# EAGLE board PCB1 (EAGLE 9.3.1), part 1 of 2
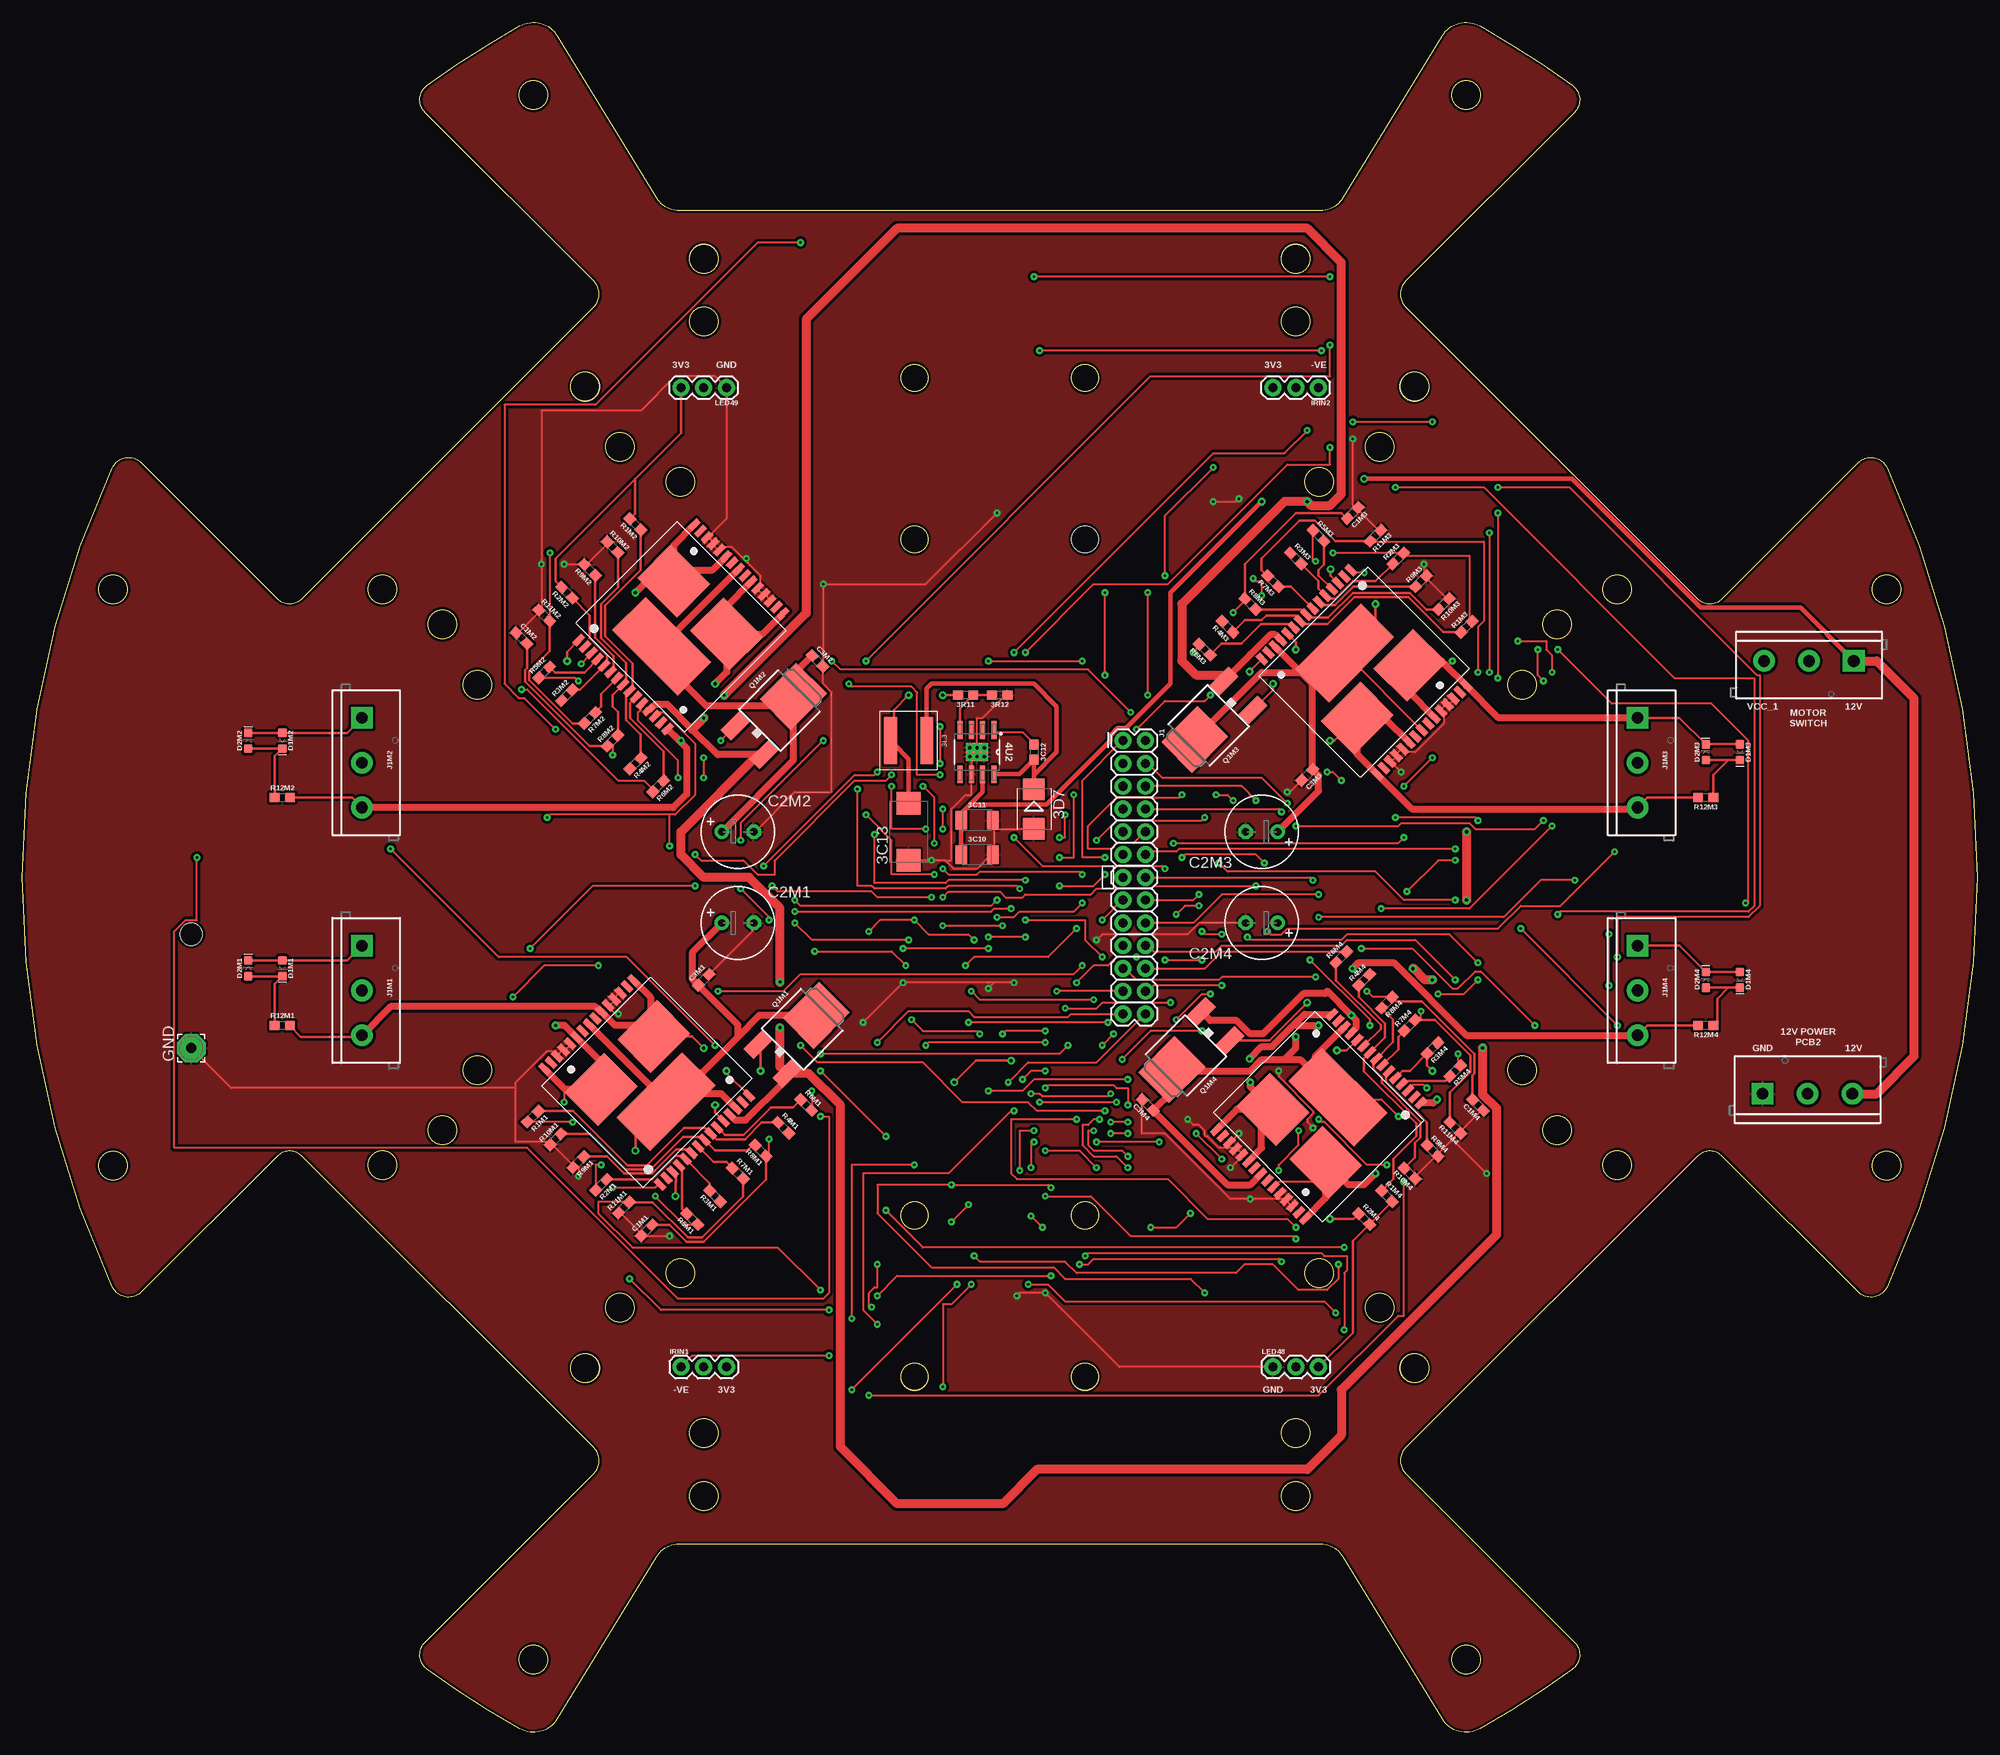
[diagram p4: board, top side]
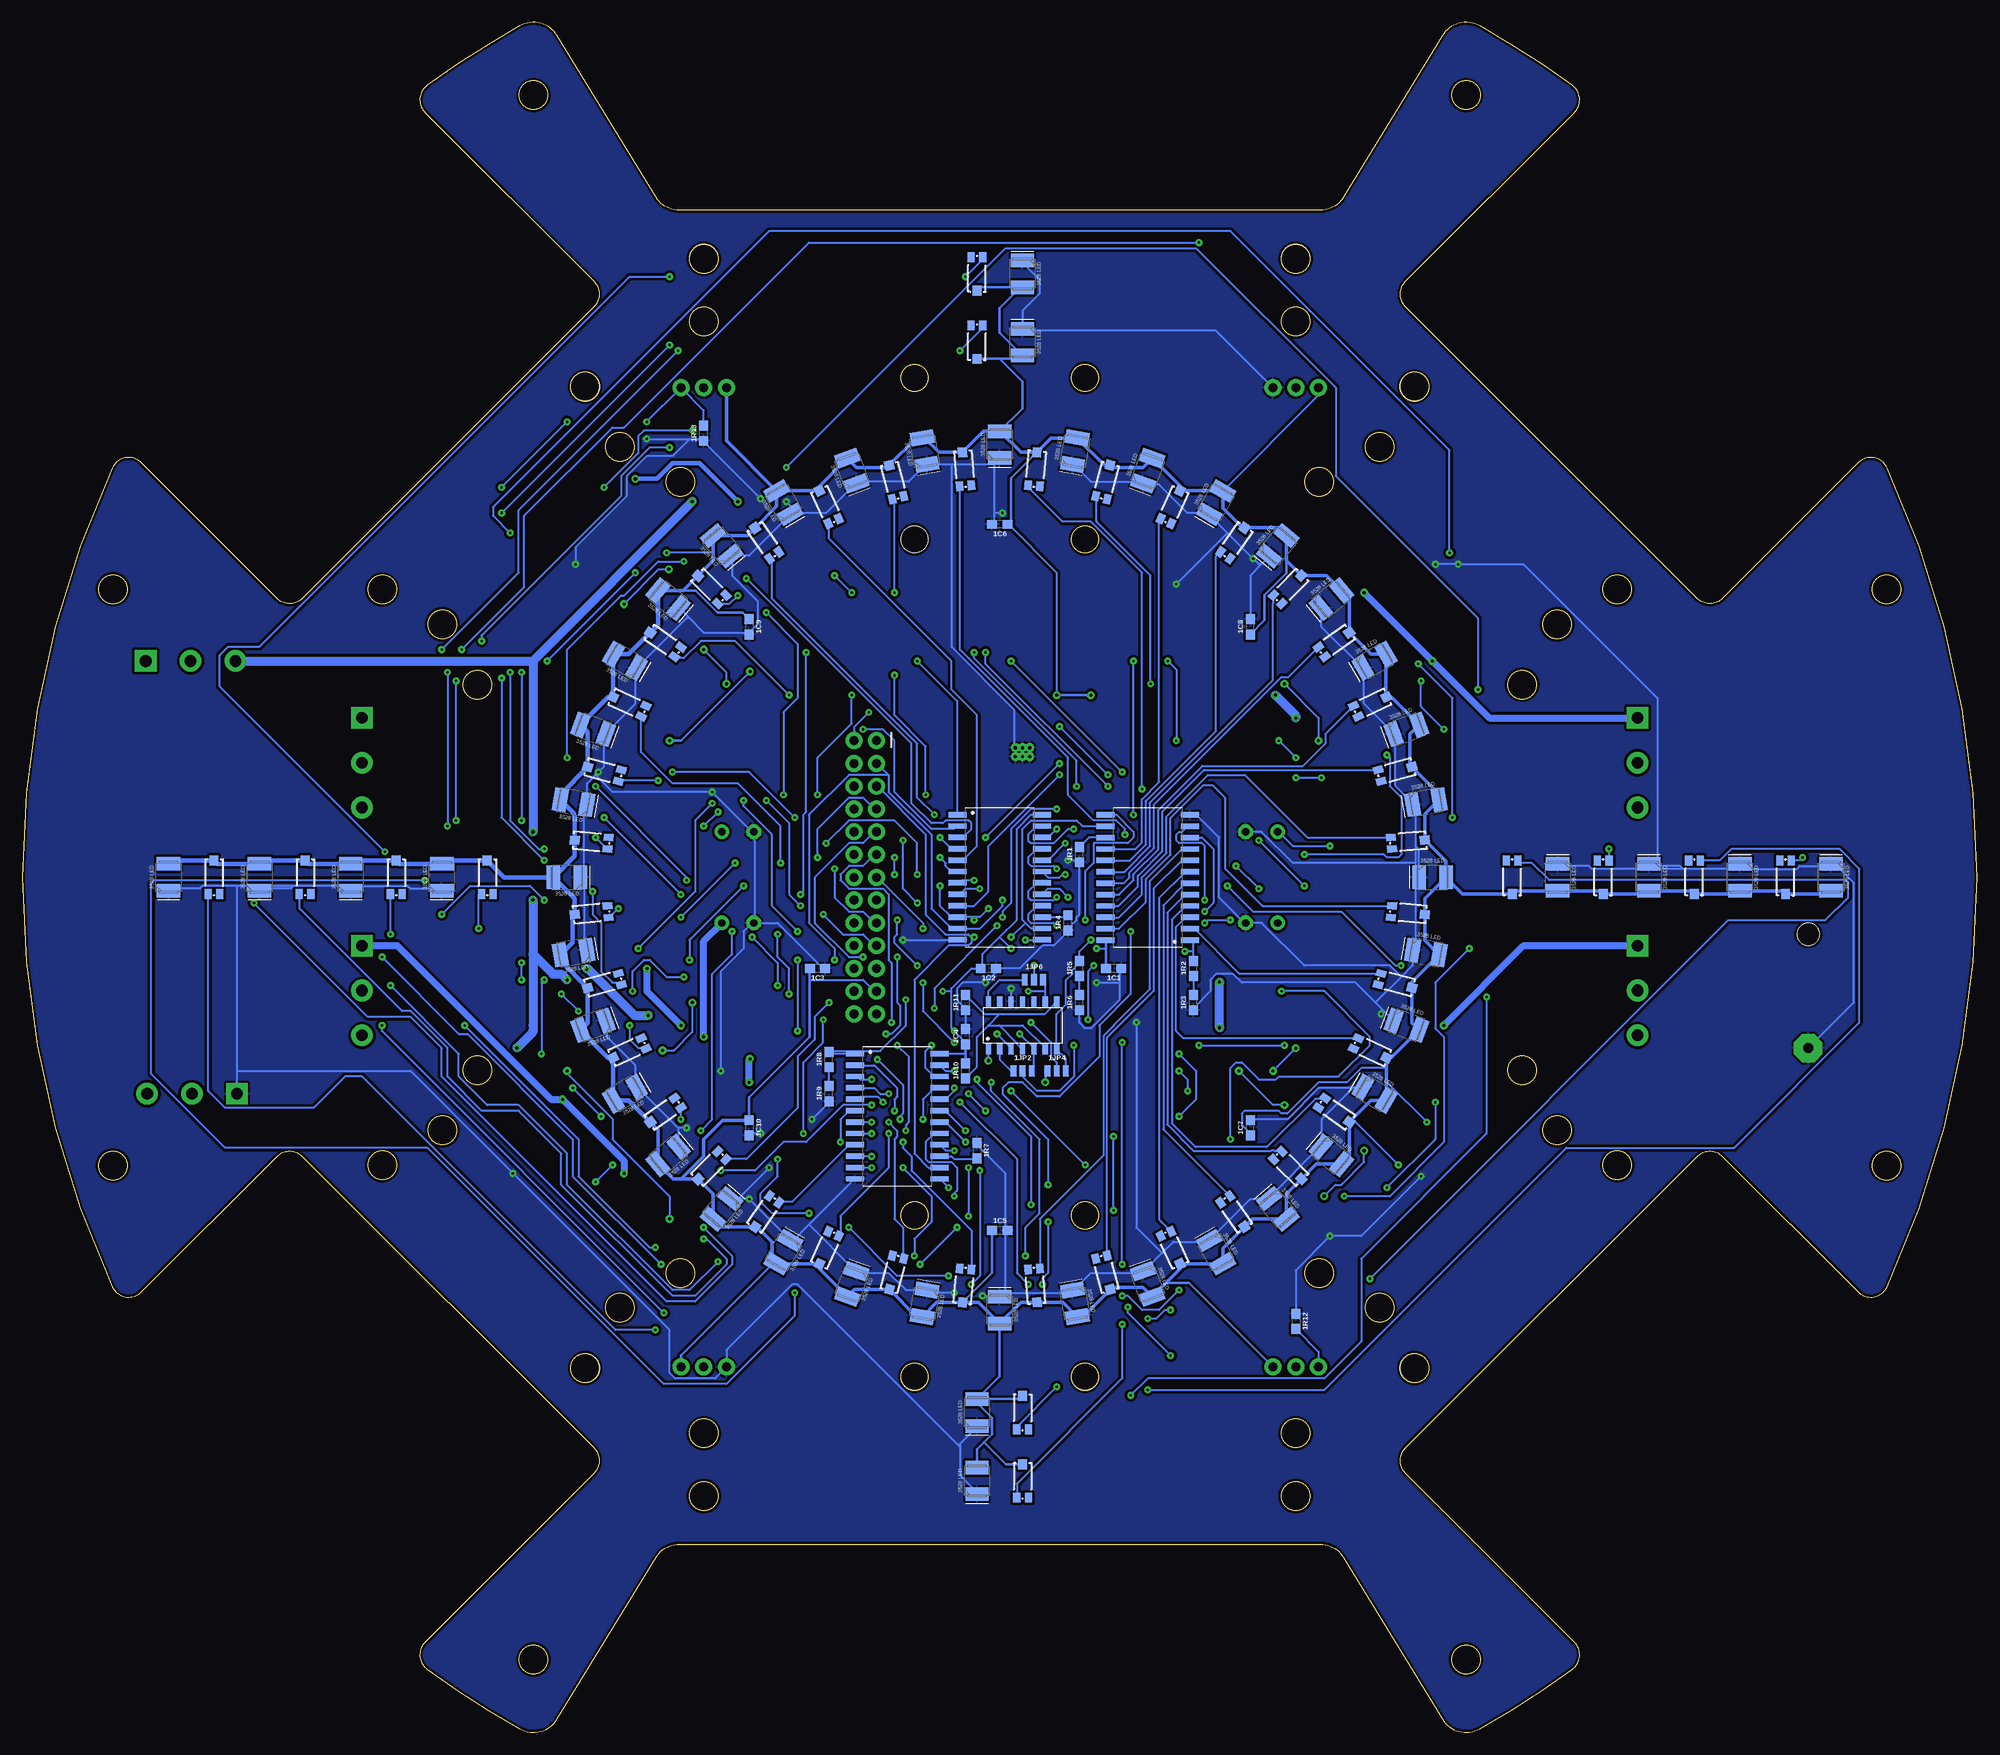
[diagram p5: board, bottom side, seen from below]

Size 218 x 190.7 mm. Coordinates in mm from the lower left corner, seen from the top.
Outline: 207.97,141.02 arc-50 207.97,49.68 arc-110 204.74,49.11 189.61,64.24 arc90 186.78,64.24 154.26,31.71 arc90 154.26,28.88 173.09,10.05 arc-99 172.85,7.01 arc-6 162.53,0.4 arc-88 158.35,1.49 147.34,19.52 arc59 144.78,20.95 73.22,20.95 arc59 70.66,19.52 59.65,1.49 arc-88 55.48,0.4 arc-6 45.15,7.01 arc-99 44.91,10.05 63.75,28.88 arc90 63.75,31.71 31.22,64.24 arc90 28.39,64.24 13.26,49.11 arc-110 10.03,49.68 arc-50 10.03,141.02 arc-110 13.26,141.6 28.39,126.46 arc90 31.22,126.46 63.75,158.99 arc90 63.75,161.82 44.91,180.66 arc-99 45.15,183.69 arc-6 55.48,190.3 arc-88 59.65,189.22 70.66,171.19 arc59 73.22,169.75 144.78,169.75 arc59 147.34,171.19 158.35,189.22 arc-88 162.53,190.3 arc-6 172.85,183.69 arc-99 173.09,180.66 154.26,161.82 arc90 154.26,158.99 186.78,126.46 arc90 189.61,126.46 204.74,141.6 arc-110 207.97,141.02
Outline: circle at 118.5,57.65 radius 1.5
Outline: circle at 118.5,39.65 radius 1.5
Outline: circle at 99.5,57.65 radius 1.5
Outline: circle at 99.5,39.65 radius 1.5
Outline: circle at 46.85,67.14 radius 1.6
Outline: circle at 66.64,47.34 radius 1.6
Outline: circle at 50.73,73.86 radius 1.6
Outline: circle at 40.13,63.25 radius 1.6
Outline: circle at 62.76,40.62 radius 1.6
Outline: circle at 73.36,51.23 radius 1.6
Outline: circle at 171.15,67.14 radius 1.6
Outline: circle at 151.36,47.34 radius 1.6
Outline: circle at 167.27,73.86 radius 1.6
Outline: circle at 177.87,63.25 radius 1.6
Outline: circle at 155.24,40.62 radius 1.6
Outline: circle at 144.64,51.23 radius 1.6
Outline: circle at 10.09,63.21 radius 1.6
Outline: circle at 207.91,63.21 radius 1.6
Outline: circle at 76,26.35 radius 1.6
Outline: circle at 76,33.35 radius 1.6
Copper layers (1*16): Top 0.035mm / dielectric 1.5mm / Bottom 0.035mm
Design rules "mine *": minimum track width 8mil, minimum drill 10mil, track to track 8mil, track to pad 8mil, pad to pad 8mil, via to via 8mil, smd to smd 8mil, copper to edge 8mil, drill to drill 8mil, minimum pad ring 12mil, minimum via ring 10mil, stop-mask expansion 4mil, vias tented up to drill 25mil, thermal gap 10mil
Holes 2.5 mm at 18.83,89
Holes 3 mm at 118.5,133.05 99.5,133.05 99.5,151.05 118.5,151.05 118.5,57.65 99.5,57.65 99.5,39.65 118.5,39.65
Holes 3.2 mm at 76,164.35 76,157.35 73.36,139.47 62.76,150.08 66.64,143.36 57,182.6 151.36,143.36 161,182.6 142,164.35 142,157.35 155.24,150.08 144.64,139.47 50.73,116.85 46.85,123.57 40.13,127.45 10.09,127.49 10.09,63.21 40.13,63.25 46.85,67.14 50.73,73.86 73.36,51.23 66.64,47.34 62.76,40.62 76,33.35 76,26.35 57,8.1 142,33.35 142,26.35 161,8.1 155.24,40.62 151.36,47.34 144.64,51.23 177.87,63.25 171.15,67.14 167.27,73.86 207.91,63.21 207.91,127.49 177.87,127.45 171.15,123.57 167.27,116.85

## Footprints (pad centres in the part's own frame; a part is rotated, then mirrored left to right if it is on the bottom)
0603 = smd 1.1 x 1: 1 -0.85,0; 2 0.85,0
SMT-JUMPER_3_0-NO_TRACE_NO-SILK = smd 0.635 x 1.27: 1 -1.016,0; 2 0,0; 3 1.016,0
SOIC-14 = smd 1.18 x 0.58: P1 -2.66,3.81; P2 -2.66,2.54; P3 -2.66,1.27; P4 -2.66,0; P5 -2.66,-1.27; P6 -2.66,-2.54; P7 -2.66,-3.81; P8 2.66,-3.81; P9 2.66,-2.54; P10 2.66,-1.27; P11 2.66,0; P12 2.66,1.27; P13 2.66,2.54; P14 2.66,3.81
SOIC-24 = smd 2 x 0.6: P1 -4.7,7; P2 -4.7,5.73; P3 -4.7,4.46; P4 -4.7,3.19; P5 -4.7,1.92; P6 -4.7,0.65; P7 -4.7,-0.62; P8 -4.7,-1.89; P9 -4.7,-3.16; P10 -4.7,-4.43; P11 -4.7,-5.7; P12 -4.7,-6.97; P13 4.7,-6.97; P14 4.7,-5.7; P15 4.7,-4.43; P16 4.7,-3.16; P17 4.7,-1.89; P18 4.7,-0.62; P19 4.7,0.65; P20 4.7,1.92; P21 4.7,3.19; P22 4.7,4.46; P23 4.7,5.73; P24 4.7,7
1210 = smd 1.27 x 2.06: 1 -1.755,0; 2 1.755,0
D/7343-31R = smd 2.55 x 2.7: + 3.175,0; - -3.175,0
SMB = smd 2.4 x 2.4: A 2.2,0; C -2.2,0
XAL6060 = smd 1.43 x 5.24: 1 -2.02,0; 2 2.02,0
POWERPAD-SOIC-8 = smd 1.981 x 0.559: 1 -2.464,1.905; 2 -2.464,0.635; 3 -2.464,-0.635; 4 -2.464,-1.905; 5 2.464,-1.905; 6 2.464,-0.635; 7 2.464,0.635; 8 2.464,1.905 | smd 2.007 x 2.489: 9 0,0 | drill 0.381: P$1 -0.5,0.8; P$2 0.5,0.8; P$3 -0.5,0; P$4 0.5,0; P$5 -0.5,-0.8; P$6 0.5,-0.8
E3,5-8 = drill 0.813 pad 1.6: + -1.778,0 | drill 0.813 pad 1.6 octagon: - 1.778,0
LED-0603 = smd 1 x 1: A -0.877,0; C 0.877,0
3,17/1,1 = drill 1.118 pad 3.175 octagon: 1 0,0
1X03 = drill 1.016 pad 1.88: 1 0,0; 2 2.54,0; 3 5.08,0
2X13 = drill 1.016 pad 1.88: 1 0,0; 2 0,2.54; 3 2.54,0; 4 2.54,2.54; 5 5.08,0; 6 5.08,2.54; 7 7.62,0; 8 7.62,2.54; 9 10.16,0; 10 10.16,2.54; 11 12.7,0; 12 12.7,2.54; 13 15.24,0; 14 15.24,2.54; 15 17.78,0; 16 17.78,2.54; 17 20.32,0; 18 20.32,2.54; 19 22.86,0; 20 22.86,2.54; 21 25.4,0; 22 25.4,2.54; 23 27.94,0; 24 27.94,2.54; 25 30.48,0; 26 30.48,2.54
SCREWTERMINAL-5MM-3 = drill 1.3 pad 2.413 square: 1 0,0 | drill 1.3 pad 2.413: 2 5,0; 3 10,0
3528 = smd 1.5 x 2.6: A -1.5,0; C 1.5,0
TEMT6000 = smd 1.1 x 0.8: BASE -1.87,-0.65; EMITTER -1.87,0.65 | smd 1.1 x 1: COLLECTOR 1.86,0.01
DPAK = smd 1.6 x 3: 1 -2.28,-5.31; 3 2.28,-5.31 | smd 4.826 x 5.715: 4 0,1.588
POWERSO-30 = smd 0.65 x 1.4: P1 -7,-9.1; P2 -6,-9.1; P3 -5,-9.1; P4 -4,-9.1; P5 -3,-9.1; P6 -2,-9.1; P7 -1,-9.1; P8 0,-9.1; P9 1,-9.1; P10 2,-9.1; P11 3,-9.1; P12 4,-9.1; P13 5,-9.1; P14 6,-9.1; P15 7,-9.1; P16 7,9.1; P17 6,9.1; P18 5,9.1; P19 4,9.1; P20 3,9.1; P21 2,9.1; P22 1,9.1; P23 0,9.1; P24 -1,9.1; P25 -2,9.1; P26 -3,9.1; P27 -4,9.1; P28 -5,9.1; P29 -6,9.1; P30 -7,9.1 | smd 10.3 x 5.25: SLUG1 0,-3.05 | smd 6.23 x 5.25: SLUG2 -4.165,3.05; SLUG3 4.165,3.05

## Placement (x,y rotation side)
1C1  0.1uF  [0603]  96.3,85.19 180 bottom
1C2  0.1uF  [0603]  110.27,85.19 180 bottom
1C3  0.1uF  [0603]  129.32,85.19 180 bottom
1C4  0.1uF  [0603]  112.81,77.57 90 bottom
1C5  1.0uF  [0603]  109,55.98 0 bottom
1C6  1.0uF  [0603]  109,134.72 180 bottom
1C7  1.0uF  [0603]  81.06,67.41 90 bottom
1C8  1.0uF  [0603]  81.06,123.29 90 bottom
1C9  1.0uF  [0603]  136.94,123.29 270 bottom
1C10  1.0uF  [0603]  136.94,67.41 270 bottom
1JP2  JUMPER-SMT_3_NO_NO_SILK  [SMT-JUMPER_3_0-NO_TRACE_NO-SILK]  106.46,73.76 0 bottom
1JP4  JUMPER-SMT_3_NO_NO_SILK  [SMT-JUMPER_3_0-NO_TRACE_NO-SILK]  102.65,73.76 0 bottom
1JP6  JUMPER-SMT_3_NO_NO_SILK  [SMT-JUMPER_3_0-NO_TRACE_NO-SILK]  105.19,83.92 0 bottom
1R1  1k  [0603]  100.11,97.89 90 bottom
1R2  1.5k  [0603]  87.41,85.19 90 bottom
1R3  [0603]  87.41,81.38 90 bottom
1R4  1k  [0603]  101.38,90.27 90 bottom
1R5  1.5k  [0603]  100.11,85.19 90 bottom
1R6  [0603]  100.11,81.38 90 bottom
1R7  1k  [0603]  111.54,64.87 270 bottom
1R8  1.5k  [0603]  128.05,75.03 90 bottom
1R9  [0603]  128.05,71.22 90 bottom
1R10  1.5k  [0603]  112.81,73.76 90 bottom
1R11  1.5k  [0603]  112.81,81.38 90 bottom
1R12  [0603]  75.98,45.82 270 bottom
1R13  [0603]  142.02,144.88 90 bottom
1U1  [SOIC-14]  106.46,78.84 90 bottom
1U2  CD74HC4067  [SOIC-24]  92.49,95.35 180 bottom
1U3  CD74HC4067  [SOIC-24]  109,95.35 0 bottom
1U4  CD74HC4067  [SOIC-24]  120.43,68.68 0 bottom
3C10  22.0uF  [1210]  106.46,97.89 0 top
3C11  22.0uF  [1210]  106.46,101.7 0 top
3C12  10nF  [0603]  112.81,109.32 270 top
3C13  470uF  [D/7343-31R]  98.84,100.43 90 top
3D7  SS54  [SMB]  112.81,102.97 270 top
3L3  XAL6060/10uH  [XAL6060]  98.84,110.59 180 top
3R11  10k  [0603]  105.19,115.67 180 top
3R12  5.9k  [0603]  109,115.67 180 top
4U2  3.1v  [POWERPAD-SOIC-8]  106.46,109.32 270 top
C1M1  33nF  [0603]  69.63,55.98 45 top
C1M2  33nF  [0603]  55.66,122.02 315 top
C1M3  33nF  [0603]  148.37,135.99 225 top
C1M4  33nF  [0603]  162.34,69.95 135 top
C2M1  680uF  [E3,5-8]  79.79,90.27 0 top
C2M2  680uF  [E3,5-8]  79.79,100.43 0 top
C2M3  680uF  [E3,5-8]  138.21,100.43 180 top
C2M4  680uF  [E3,5-8]  138.21,90.27 180 top
C3M1  1.0uF  [0603]  75.98,83.92 45 top
C3M2  1.0uF  [0603]  88.68,119.48 315 top
C3M3  1.0uF  [0603]  143.29,106.78 225 top
C3M4  1.0uF  [0603]  125.51,69.95 135 top
D1M1  GREEN  [LED-0603]  28.99,85.19 270 top
D1M2  GREEN  [LED-0603]  28.99,110.59 270 top
D1M3  GREEN  [LED-0603]  191.55,109.32 270 top
D1M4  GREEN  [LED-0603]  191.55,83.92 270 top
D2M1  RED  [LED-0603]  25.18,85.19 90 top
D2M2  RED  [LED-0603]  25.18,110.59 90 top
D2M3  RED  [LED-0603]  187.74,109.32 90 top
D2M4  RED  [LED-0603]  187.74,83.92 90 top
GND  [3,17/1,1]  18.83,76.3 90 top
IRIN1  [1X03]  73.44,40.74 0 top
IRIN2  [1X03]  144.56,149.96 180 top
J1  [2X13]  122.73,110.59 270 top
J1M1  [SCREWTERMINAL-5MM-3]  37.88,87.73 270 top
J1M2  [SCREWTERMINAL-5MM-3]  37.88,113.13 270 top
J1M3  [SCREWTERMINAL-5MM-3]  180.12,113.13 270 top
J1M4  [SCREWTERMINAL-5MM-3]  180.12,87.73 270 top
J2  [SCREWTERMINAL-5MM-3]  194.09,71.22 0 top
J6  [SCREWTERMINAL-5MM-3]  204.25,119.48 180 top
LED0  3528LED  [3528]  109,47.09 90 bottom
LED1  3528LED  [3528]  100.62,47.82 100 bottom
LED2  3528LED  [3528]  92.49,50 110 bottom
LED3  3528LED  [3528]  84.87,53.56 120 bottom
LED4  3528LED  [3528]  77.98,58.38 130 bottom
LED5  3528LED  [3528]  72.03,64.33 140 bottom
LED6  3528LED  [3528]  67.21,71.22 150 bottom
LED7  3528LED  [3528]  63.65,78.85 160 bottom
LED8  3528LED  [3528]  61.47,86.97 170 bottom
LED9  3528LED  [3528]  60.74,95.35 180 bottom
LED10  3528LED  [3528]  61.47,103.73 190 bottom
LED11  3528LED  [3528]  63.65,111.86 200 bottom
LED12  3528LED  [3528]  67.21,119.48 210 bottom
LED13  3528LED  [3528]  72.03,126.37 220 bottom
LED14  3528LED  [3528]  77.98,132.32 230 bottom
LED15  3528LED  [3528]  84.87,137.15 240 bottom
LED16  3528LED  [3528]  92.49,140.7 250 bottom
LED17  3528LED  [3528]  100.62,142.88 260 bottom
LED18  3528LED  [3528]  109,143.61 270 bottom
LED19  3528LED  [3528]  117.38,142.88 280 bottom
LED20  3528LED  [3528]  125.51,140.7 290 bottom
LED21  3528LED  [3528]  133.13,137.15 300 bottom
LED22  3528LED  [3528]  140.02,132.32 310 bottom
LED23  3528LED  [3528]  145.97,126.37 320 bottom
LED24  3528LED  [3528]  150.79,119.48 330 bottom
LED25  3528LED  [3528]  154.35,111.86 340 bottom
LED26  3528LED  [3528]  156.53,103.73 350 bottom
LED27  3528LED  [3528]  157.26,95.35 0 bottom
LED28  3528LED  [3528]  156.53,86.97 10 bottom
LED29  3528LED  [3528]  154.35,78.85 20 bottom
LED30  3528LED  [3528]  150.79,71.22 30 bottom
LED31  3528LED  [3528]  145.97,64.33 40 bottom
LED32  3528LED  [3528]  140.02,58.38 50 bottom
LED33  3528LED  [3528]  133.13,53.56 60 bottom
LED34  3528LED  [3528]  125.51,50 70 bottom
LED35  3528LED  [3528]  117.38,47.82 80 bottom
LED36  3528LED  [3528]  111.54,35.66 270 bottom
LED37  3528LED  [3528]  111.54,28.04 270 bottom
LED38  3528LED  [3528]  46.77,95.35 90 bottom
LED39  3528LED  [3528]  36.61,95.35 90 bottom
LED40  3528LED  [3528]  26.45,95.35 90 bottom
LED41  3528LED  [3528]  16.29,95.35 90 bottom
LED42  3528LED  [3528]  106.46,155.04 90 bottom
LED43  3528LED  [3528]  106.46,162.66 90 bottom
LED44  3528LED  [3528]  171.23,95.35 270 bottom
LED45  3528LED  [3528]  181.39,95.35 270 bottom
LED46  3528LED  [3528]  191.55,95.35 270 bottom
LED47  3528LED  [3528]  201.71,95.35 270 bottom
LED48  [1X03]  139.48,40.74 0 top
LED49  [1X03]  78.52,149.96 180 top
PT0  TEMT6000  [TEMT6000]  105.02,49.81 275 bottom
PT1  TEMT6000  [TEMT6000]  97.17,51.19 285 bottom
PT2  TEMT6000  [TEMT6000]  89.68,53.92 295 bottom
PT3  TEMT6000  [TEMT6000]  82.78,57.9 305 bottom
PT4  TEMT6000  [TEMT6000]  76.67,63.02 315 bottom
PT5  TEMT6000  [TEMT6000]  71.55,69.13 325 bottom
PT6  TEMT6000  [TEMT6000]  67.56,76.03 335 bottom
PT7  TEMT6000  [TEMT6000]  64.84,83.52 345 bottom
PT8  TEMT6000  [TEMT6000]  63.45,91.37 355 bottom
PT9  TEMT6000  [TEMT6000]  63.45,99.34 5 bottom
PT10  TEMT6000  [TEMT6000]  64.84,107.18 15 bottom
PT11  TEMT6000  [TEMT6000]  67.56,114.67 25 bottom
PT12  TEMT6000  [TEMT6000]  71.55,121.58 35 bottom
PT13  TEMT6000  [TEMT6000]  76.67,127.68 45 bottom
PT14  TEMT6000  [TEMT6000]  82.78,132.8 55 bottom
PT15  TEMT6000  [TEMT6000]  89.68,136.79 65 bottom
PT16  TEMT6000  [TEMT6000]  97.17,139.51 75 bottom
PT17  TEMT6000  [TEMT6000]  105.02,140.9 85 bottom
PT18  TEMT6000  [TEMT6000]  112.98,140.9 95 bottom
PT19  TEMT6000  [TEMT6000]  120.83,139.51 105 bottom
PT20  TEMT6000  [TEMT6000]  128.32,136.79 115 bottom
PT21  TEMT6000  [TEMT6000]  135.22,132.8 125 bottom
PT22  TEMT6000  [TEMT6000]  141.33,127.68 135 bottom
PT23  TEMT6000  [TEMT6000]  146.45,121.58 145 bottom
PT24  TEMT6000  [TEMT6000]  150.44,114.67 155 bottom
PT25  TEMT6000  [TEMT6000]  153.16,107.18 165 bottom
PT26  TEMT6000  [TEMT6000]  154.55,99.34 175 bottom
PT27  TEMT6000  [TEMT6000]  154.55,91.37 185 bottom
PT28  TEMT6000  [TEMT6000]  153.16,83.52 195 bottom
PT29  TEMT6000  [TEMT6000]  150.44,76.03 205 bottom
PT30  TEMT6000  [TEMT6000]  146.45,69.13 215 bottom
PT31  TEMT6000  [TEMT6000]  141.33,63.02 225 bottom
PT32  TEMT6000  [TEMT6000]  135.22,57.9 235 bottom
PT33  TEMT6000  [TEMT6000]  128.32,53.92 245 bottom
PT34  TEMT6000  [TEMT6000]  120.83,51.19 255 bottom
PT35  TEMT6000  [TEMT6000]  112.98,49.81 265 bottom
PT36  TEMT6000  [TEMT6000]  106.46,35.66 90 bottom
PT37  TEMT6000  [TEMT6000]  106.46,28.04 90 bottom
PT38  TEMT6000  [TEMT6000]  51.85,95.35 270 bottom
PT39  TEMT6000  [TEMT6000]  41.69,95.35 270 bottom
PT40  TEMT6000  [TEMT6000]  31.53,95.35 270 bottom
PT41  TEMT6000  [TEMT6000]  21.37,95.35 270 bottom
PT42  TEMT6000  [TEMT6000]  111.54,155.04 270 bottom
PT43  TEMT6000  [TEMT6000]  111.54,162.66 270 bottom
PT44  TEMT6000  [TEMT6000]  166.15,95.35 90 bottom
PT45  TEMT6000  [TEMT6000]  176.31,95.35 90 bottom
PT46  TEMT6000  [TEMT6000]  186.47,95.35 90 bottom
PT47  TEMT6000  [TEMT6000]  196.63,95.35 90 bottom
Q1M1  AOD482  [DPAK]  87.41,78.84 315 top
Q1M2  AOD482  [DPAK]  84.87,114.4 315 top
Q1M3  AOD482  [DPAK]  131.86,111.86 135 top
Q1M4  AOD482  [DPAK]  129.32,75.03 135 top
R1M1  3.3k  [0603]  56.93,68.68 225 top
R1M2  3.3k  [0603]  68.36,134.72 135 top
R1M3  3.3k  [0603]  161.07,123.29 45 top
R1M4  3.3k  [0603]  152.18,59.79 315 top
R2M1  3.3k  [0603]  64.55,61.06 225 top
R2M2  3.3k  [0603]  60.74,127.1 135 top
R2M3  3.3k  [0603]  153.45,130.91 45 top
R2M4  3.3k  [0603]  149.64,57.25 315 top
R3M1  1k  [0603]  77.25,59.79 135 top
R3M2  1k  [0603]  60.74,115.67 45 top
R3M3  1k  [0603]  142.02,130.91 315 top
R3M4  1k  [0603]  157.26,76.3 225 top
R4M1  1k  [0603]  84.87,67.41 315 top
R4M2  1k  [0603]  68.36,108.05 225 top
R4M3  1k  [0603]  134.4,123.29 135 top
R4M4  1k  [0603]  149.64,83.92 45 top
R5M1  1k  [0603]  74.71,57.25 135 top
R5M2  1k  [0603]  58.2,118.21 45 top
R5M3  1k  [0603]  144.56,133.45 315 top
R5M4  1k  [0603]  159.8,73.76 225 top
R6M1  1k  [0603]  87.41,69.95 315 top
R6M2  1k  [0603]  70.9,105.51 225 top
R6M3  1k  [0603]  131.86,120.75 135 top
R6M4  1k  [0603]  147.1,86.46 45 top
R7M1  1k  [0603]  79.79,62.33 315 top
R7M2  1k  [0603]  63.28,113.13 225 top
R7M3  1k  [0603]  139.48,128.37 135 top
R7M4  1k  [0603]  154.72,78.84 45 top
R8M1  10k  [0603]  82.33,64.87 135 top
R8M2  10k  [0603]  65.82,110.59 45 top
R8M3  10k  [0603]  136.94,125.83 315 top
R8M4  10k  [0603]  152.18,81.38 225 top
R9M1  10k  [0603]  62.01,63.6 225 top
R9M2  10k  [0603]  63.28,129.64 135 top
R9M3  10k  [0603]  155.99,128.37 45 top
R9M4  10k  [0603]  157.26,64.87 315 top
R10M1  1k  [0603]  59.47,66.14 45 top
R10M2  1k  [0603]  65.82,132.18 315 top
R10M3  1k  [0603]  158.53,125.83 225 top
R10M4  1k  [0603]  154.72,62.33 135 top
R11M1  10k  [0603]  67.09,58.52 45 top
R11M2  10k  [0603]  58.2,124.56 315 top
R11M3  10k  [0603]  150.91,133.45 225 top
R11M4  10k  [0603]  159.8,67.41 135 top
R12M1  4.7k  [0603]  28.99,78.84 0 top
R12M2  4.7k  [0603]  28.99,104.24 0 top
R12M3  4.7k  [0603]  187.74,104.24 180 top
R12M4  4.7k  [0603]  187.74,78.84 180 top
U1M1  VNH5019  [POWERSO-30]  69.63,72.49 45 top
U1M2  VNH5019  [POWERSO-30]  73.44,123.29 315 top
U1M3  VNH5019  [POWERSO-30]  149.64,118.21 225 top
U1M4  VNH5019  [POWERSO-30]  144.56,68.68 135 top

## Tracks (layer width: path | path; a pad name or v marks a point on that pad's centre or on a via)
3.3V  (via drill 0.25, 0.35)
  Top 0.203: v109.32,77.89 109.64,78.21 v114.08,78.21 | v107.73,87.41 v98.21,87.41 | R1M3.2 161.39,123.93 161.39,131.23 154.09,131.23 R2M3.2 153.77,131.55 v146.15,131.55 | v64.55,63.28 63.92,63.28 63.92,60.74 R2M1.2 | v61.38,68.05 56.61,68.05 R1M1.2 | J1.23 v115.35,82.65
  Top 0.254: LED49.3 73.44,144.88 68.35,139.79 | R1M4.2 R2M4.2 148.37,54.78 148.37,44.55 LED48.3 | 68.35,139.79 68.35,135.91 R1M2.2 | 68.35,139.79 59.47,130.91 59.47,128.37 R2M2.2 | 3R11.2 v102.65,115.67 | v98.84,115.67 97.2,114.03 97.2,110.22
  Top 0.508: 3C13.+ 98.84,108.57 97.2,110.22 3L3.2
  Bottom 0.203: 114.4,82.65 114.4,78.52 v114.08,78.21 112.81,76.94 1C4.1 | 114.4,82.65 114.4,82.97 112.18,85.19 1C2.2 110.91,85.19 110.91,86.78 109,88.68 | v109.32,77.89 107.73,76.3 1U1.P3 | 112.81,75.67 115.67,75.67 1U4.P24 | 109,88.68 107.1,90.59 107.1,100.75 105.51,102.34 104.56,102.34 1U3.P24 | v98.21,87.41 97.15,87.41 | 109,88.68 v107.73,87.41 | v64.55,63.28 69.63,68.36 PT5.COLLECTOR | 1C7.1 81.06,66.78 82.01,67.73 82.01,69 81.7,69.32 77.89,69.32 77.57,69 76.93,69 73.44,72.49 70.27,72.49 68.68,74.08 65.82,74.08 PT6.COLLECTOR | v61.38,68.05 65.82,72.49 65.87,70.5 | 130.21,83.92 124.24,83.92 122.97,82.65 J1.23 | v146.15,131.55 141.07,131.55 140.99,130.65 | LED42.A 106.46,153.45 106.78,153.14 106.82,153.18 | v102.65,115.67 102.65,129.32 108.05,134.72 1C6.1 | v115.35,82.65 114.4,82.65
  Bottom 0.254: LED36.A 106.83,37.16 PT36.COLLECTOR | LED36.A 109,39.7 LED0.A | LED37.A 111.54,31.55 110.76,32.34 | LED36.A 111.54,36.77 109.85,35.07 109.85,33.25 110.76,32.34 | PT37.COLLECTOR 108.32,29.9 110.76,32.34 | LED48.3 144.56,42.01 134.1,52.47 | LED18.A 106.46,147.65 106.46,150.64 109,153.18 | PT42.COLLECTOR 109,153.18 | 109,153.18 106.82,153.18 | 106.69,161.16 109,158.85 109,156.08 LED42.A | LED43.A 111.17,161.16 | LED15.A 73.44,149.12 LED49.3 | IRIN1.3 87.91,50.13 90.45,50.13 | 1C3.2 130.21,85.23 130.21,83.92 130.21,77.53 136.94,70.8 1C10.1 | 1R10.2 112.81,75.67 1C4.1 | 1C1.2 97.15,87.41 97.15,88.31 1U2.P24 | v102.65,115.67 v98.84,115.67 | PT35.COLLECTOR 109.85,51.24 1C5.1 | 1C6.1 107.73,135.14 107.73,139.88 PT17.COLLECTOR | 1C9.1 137.7,124.9 140.5,124.9 142.94,127.34 144.3,127.34 | 1C8.1 79.46,124.05 79.46,126.85 77.02,129.29 77.02,132.18
  Bottom 0.381: LED33.A 133.85,52.23 PT33.COLLECTOR 129.1,51.67 LED34.A 125.22,49.39 PT34.COLLECTOR 118.26,46.35 LED35.A 116.07,47.92 115.87,47.92 115.83,47.95 PT35.COLLECTOR 111.36,47.95 LED0.A 106.64,47.95 PT0.COLLECTOR 102.17,47.95 102.14,47.92 101.93,47.92 LED1.A 99.72,46.35 PT1.COLLECTOR 96.44,49.63 93.02,49.63 LED2.A 90.45,50.13 88.88,51.69 PT2.COLLECTOR 88.86,52.26 LED3.A 84.12,53.96 PT3.COLLECTOR 80.83,57.25 78.52,57.25 78.5,57.23 LED4.A 77.02,60.05 PT4.COLLECTOR 73.7,63.37 LED5.A 70.02,64.23 PT5.COLLECTOR 67.62,70.47 LED6.A 65.87,70.5 PT6.COLLECTOR 65.32,75.25 LED7.A 63.04,79.13 PT7.COLLECTOR 63.04,83.67 LED8.A 61.57,88.28 61.57,88.49 61.6,88.52 PT8.COLLECTOR 61.6,92.99 LED9.A | LED33.A 134.1,52.47 | 144.56,61.7 PT31.COLLECTOR 140.99,60.05 LED32.A 140.12,56.37 PT32.COLLECTOR 136.06,56.37 134.4,54.71 134.4,52.78 LED33.A | 144.56,61.7 145.45,61.7 LED31.A 147.12,67.2 PT30.COLLECTOR | LED21.A 133.86,138.47 PT20.COLLECTOR 129.12,139.01 LED20.A 124.98,141.07 121.56,141.07 PT19.COLLECTOR 118.28,144.36 LED19.A 117.36,144.36 115.76,142.75 PT18.COLLECTOR 110.8,145.11 LED18.A 106.64,142.75 PT17.COLLECTOR 103.26,144.36 LED17.A 97.32,141.31 PT16.COLLECTOR 96.62,141.39 96.3,141.07 93.02,141.07 LED16.A 88.9,139.03 PT15.COLLECTOR 84.15,138.48 LED15.A 84.12,136.51 81.94,134.33 PT14.COLLECTOR 77.88,134.33 LED14.A 77.02,132.18 77.02,130.65 PT13.COLLECTOR 72.55,129 LED13.A 70.03,126.49 PT12.COLLECTOR 67.61,120.23 LED12.A 65.91,115.49 PT11.COLLECTOR 65.34,115.47 LED11.A 63.28,111.33 63.28,107.91 PT10.COLLECTOR 60,104.63 LED10.A 61.57,102.42 61.57,102.22 61.6,102.18 PT9.COLLECTOR 59.24,97.15 LED9.A
  Bottom 0.381: 106.69,161.16 LED43.A | 111.17,161.16 PT43.COLLECTOR | LED9.A 57.38,93.49 PT38.COLLECTOR 51.48,93.85 LED38.A 42.04,93.85 PT39.COLLECTOR 36.97,93.49 LED39.A 31.88,93.85 PT40.COLLECTOR 26.81,93.49 LED40.A 21.72,93.85 PT41.COLLECTOR 16.65,93.49 LED41.A | 144.56,61.7 142.02,64.24 142.02,66.14 139.9,68.26 1C10.1 | LED23.A 144.3,127.34 PT22.COLLECTOR 140.99,130.65 LED22.A 137.15,133.47 PT21.COLLECTOR 133.88,136.74 LED21.A | LED21.A 139.48,144.04 IRIN2.3
  Bottom 0.508: LED47.A 201.35,97.21 PT47.COLLECTOR 196.28,96.85 LED46.A 191.19,97.21 PT46.COLLECTOR 186.12,96.85 LED45.A 181.03,97.21 PT45.COLLECTOR 175.96,96.85 LED44.A 170.87,97.21 PT44.COLLECTOR 164.3,95.35 LED27.A | PT30.COLLECTOR 150.39,70.47 LED30.A 152.12,70.5 PT29.COLLECTOR 152.66,75.23 LED29.A 154.96,79.14 PT28.COLLECTOR 158,86.08 LED28.A 156.66,88.06 156.66,90.94 PT27.COLLECTOR 156.4,92.99 LED27.A | LED27.A 156.4,97.71 PT26.COLLECTOR 156.4,102.08 156.5,102.17 156.5,102.49 LED26.A 158,104.61 PT25.COLLECTOR 154.96,111.57 LED25.A 152.68,115.45 PT24.COLLECTOR 152.13,120.2 LED24.A 150.38,120.23 PT23.COLLECTOR 147.12,123.5 LED23.A
12V  (via drill 0.35)
  Top 0.508: 3C10.1 3C11.1 104.71,102.49 105.7,103.48 | 4U2.7 107.1,104.88 105.7,103.48 | v149.64,139.8 172.8,139.8 187.19,125.41 198.32,125.41 J6.1 | v138.21,137.26 128.05,127.1 128.05,116.94 123.1,111.99 122.15,111.99 121.33,111.17 121.33,110.61 114.21,103.48 105.7,103.48
  Top 1.016: J6.1 206.79,119.48 210.98,115.29 210.98,75.41 206.79,71.22 J2.3
  Bottom 0.508: v149.64,139.8 147.23,139.8 145.5,141.53 142.48,141.53 v138.21,137.26
ANALOG1  (via drill 0.25)
  Top 0.203: v106.78,77.89 106.46,78.21 100.43,78.21 v99.16,79.48 | v98.52,85.51 96.94,87.1 v88.36,87.1
  Bottom 0.203: 1JP2.3 105.19,74.02 1U1.P5 105.19,76.3 v106.78,77.89 | 1R2.2 87.41,87.1 | 87.41,87.1 87.41,87.97 1U2.P1 | v99.16,79.48 99.16,84.87 v98.52,85.51 | 87.41,87.1 v88.36,87.1
ANALOG2  (via drill 0.25)
  Top 0.203: v107.73,119.48 v118.21,119.48 | v95.35,107.1 95.03,106.78 92.81,106.78 v82.65,96.62 | v80.11,94.08 83.28,90.91 v83.28,90.59 | v86.14,90.27 88.05,88.37 v98.84,88.37
  Bottom 0.203: 1JP4.3 101.63,75.17 1U1.P7 102.65,80.11 101.59,81.17 101.59,83.92 100.92,84.6 100.92,85.02 100.32,85.61 100.32,86.25 1R5.2 100.11,87.1 v98.84,88.37 | v118.21,119.48 113.76,115.04 113.76,102.34 1U3.P1 | v95.35,107.1 v107.73,119.48 | v80.11,94.08 v82.65,96.62 | v83.28,90.59 85.82,90.59 v86.14,90.27
ANALOG3  (via drill 0.25)
  Top 0.203: v105.83,82.65 106.78,81.7 v119.48,81.7
  Bottom 0.203: 1U1.P9 103.92,82.65 | 103.92,82.65 103.92,83.67 1JP6.3 | 1U4.P1 125.19,75.67 128.05,75.67 1R8.2 128.05,75.98 122.34,75.98 119.48,78.84 v119.48,81.7 | v105.83,82.65 103.92,82.65
COMP1
  Bottom 0.203: 1U1.P2 109,75.03 107.73,73.76 1JP2.1
COMP2  (via drill 0.35)
  Top 0.254: v103.92,72.49 106.33,74.9 v110.27,74.9
  Bottom 0.203: 1JP4.1 103.92,73.51 v103.92,72.49 | v110.27,74.9 1U1.P1
COMP3
  Bottom 0.203: 1U1.P14 110.27,82.65 109,83.92 1JP6.1
COMP-
  Bottom 0.203: 1R11.2 110.69,80.11 109,80.11 | 1U1.P8 103.3,80.85 103.3,80.77 103.96,80.11 109,80.11 | 1R10.1 111.54,74.18 111.54,77.57 110.27,78.84 | 110.27,78.84 109,80.11 | 1U1.P4 107.11,76.83 107.11,76.91 109.04,78.84 | 110.27,78.84 109.04,78.84 | 109.04,78.84 106.46,78.84 103.92,76.3 1U1.P6
CPM1  (via drill 0.35)
  Top 0.254: U1M1.P11 77.25,69.11 v77.25,69.95 | v82.33,73.76 82.33,76.41 Q1M1.1
  Bottom 0.203: v82.33,73.76 78.52,69.95 v77.25,69.95
CPM2  (via drill 0.25)
  Top 0.203: v73.12,106.46 73.12,108.37 68.68,112.81 68.68,113.77 69,114.08 69,114.72 U1M2.P11 | v75.98,108.69 v75.98,106.46 | v77.89,110.59 79.47,112.18 Q1M2.1
  Bottom 0.203: v75.98,106.46 v73.12,106.46 | v77.89,110.59 v75.98,108.69
CPM3  (via drill 0.35)
  Top 0.254: Q1M3.1 139.48,116.26 v139.48,116.94 | v142.02,120.75 142.02,121.59 U1M3.P11
  Bottom 0.203: v139.48,116.94 139.48,118.21 v142.02,120.75
CPM4  (via drill 0.35)
  Top 0.254: Q1M4.1 139.08,77.17 v143.29,81.38 | v146.61,76.05 147.68,76.05 U1M4.P11
  Bottom 0.203: v143.29,81.38 143.29,78.09 145.34,76.05 v146.61,76.05
CSDIS1
  Top 0.254: R9M1.1 65.22,64.2 67.09,62.33 70.24,62.33 72.9,64.99 74.3,64.99 U1M1.P6
CSDIS2
  Top 0.254: R9M2.1 63.88,122.08 65.94,120.03 65.94,118.62 U1M2.P6
CSDIS3
  Top 0.254: R9M3.1 148.43,127.77 146.38,125.71 144.97,125.71 U1M3.P6
CSDIS4
  Top 0.254: R9M4.1 156.66,68.01 155.56,69.11 155.54,69.11 152.06,72.59 152.06,73.35 U1M4.P6
CSM1  (via drill 0.25)
  Top 0.203: v120.43,90.59 122.65,92.81 J1.15 | v118.21,85.51 117.26,84.56 86.78,84.56 84.87,82.65 v77.57,82.65 | v83.28,66.14 83.28,64.55 82.97,64.55 R8M1.1
  Top 0.254: C1M1.2 72.19,56.58 74.06,54.71 75.98,54.71 82.93,61.66 R8M1.1
  Bottom 0.203: v120.43,90.59 120.43,89 120.75,88.68 120.75,88.05 v118.21,85.51 | v77.57,82.65 72.81,82.65 67.73,77.57 67.73,76.62 71.22,73.13 77.89,73.13 78.2,72.81 80.11,72.81 82.01,74.71 82.65,74.71 83.28,74.08 v83.28,66.14
CSM2  (via drill 0.25)
  Top 0.203: v127.42,96.3 127.1,96.62 113.76,96.62 v110.59,99.8 | v102.33,112.18 v102.33,108.05 | v96.94,106.78 96.3,106.15 92.81,106.15 83.92,97.26 83.92,95.67 82.01,95.67 80.43,97.26 75.66,97.26 v75.03,97.89 | v65.82,109 65.82,109.96 65.5,109.96 R8M2.1
  Top 0.254: C1M2.2 56.26,118.71 56.04,118.49 56.04,117.18 63.23,109.99 R8M2.1
  Bottom 0.203: v127.42,96.3 127.42,93.13 125.83,91.54 124.24,91.54 122.97,90.27 J1.17 | v102.33,108.05 v110.59,99.8 | v96.94,106.78 v102.33,112.18 | v75.03,97.89 66.14,97.89 65.82,97.57 64.55,97.57 64.23,97.89 64.23,104.24 65.5,105.51 65.5,108.69 v65.82,109
CSM3  (via drill 0.25)
  Top 0.203: v128.69,91.22 129.64,92.18 v131.23,92.18 | v135.04,103.92 134.4,104.56 v133.13,104.56 | v135.04,124.88 136.31,126.15 R8M3.1
  Top 0.254: R8M3.1 136.34,130.31 142.02,135.99 147.1,135.99 147.7,135.39 C1M3.2
  Bottom 0.203: v128.69,91.22 126.46,89 124.24,89 122.97,87.73 J1.19 | v131.23,92.18 132.5,93.45 132.5,101.38 v135.04,103.92 | v133.13,104.56 133.13,113.77 131.54,115.35 131.54,121.39 v135.04,124.88
CSM4  (via drill 0.25)
  Top 0.203: v144.24,84.24 133.77,84.24 133.45,83.92 124.24,83.92 122.97,85.19 J1.21 | v149.96,82.65 150.59,82.02 152.5,82.02 R8M4.1
  Top 0.254: R8M4.1 153.26,81.5 156.11,81.5 161.96,75.65 161.96,73.48 161.74,73.26 C1M4.2
  Bottom 0.203: v144.24,84.24 146.15,84.24 148.05,86.14 148.69,86.14 149.96,84.87 v149.96,82.65
GATE1  (via drill 0.25)
  Top 0.203: J1.25 116.94,80.11 116.62,79.79 106.14,79.79 105.51,80.43 98.84,80.43 v95.35,76.94 | v95.35,52.17 95.35,49.63 95.03,49.63 94.4,49 94.4,47.41 v94.71,47.41 | v89.95,42.01 74.71,42.01 IRIN1.1
  Bottom 0.203: 1R12.2 73.44,42.43 IRIN1.1 | v95.35,52.17 v95.35,76.94 | v94.71,47.41 94.71,46.77 v89.95,42.01
GATE2  (via drill 0.25)
  Top 0.203: v109.95,72.49 112.18,74.71 119.8,74.71 125.19,80.11 J1.26 | v106.14,53.12 106.78,52.49 116.3,52.49 117.57,51.22 135.35,51.22 136.31,52.17 139.48,52.17 142.34,49.31 145.51,49.31 146.78,50.58 v146.78,52.17 | v177.9,86.46 177.9,90.91 192.5,90.91 193.77,92.18 193.77,117.89 193.46,117.89 172.5,138.85 v164.56,138.85 | v148.37,146.15 v157.26,146.15
  Bottom 0.203: 1R13.2 142.02,147.42 IRIN2.1 v148.37,146.15 | v109.95,72.49 109.95,71.54 104.56,66.14 104.56,57.89 106.14,56.3 v106.14,53.12 | v146.78,52.17 156.63,62.01 156.63,66.14 168.37,77.89 169.33,77.89 v177.9,86.46 | v157.26,146.15 v164.56,138.85
GND  (via drill 0.25)
  Top 0.203: R10M4.1 155.36,62.01 157.58,64.24 R9M4.2 157.9,64.55 159.48,66.14 | 159.48,66.14 160.12,66.78 R11M4.1 160.44,67.09 162.66,69.32 C1M4.1 | v163.29,62.33 159.48,66.14 | 140.12,59.47 140.75,59.47 U1M4.P27 141.07,59.16 141.39,58.84 U1M4.P28 | 140.12,59.47 v136.94,59.47 134.72,59.47 127.42,66.78 124.88,66.78 124.88,70.27 C3M4.2 | 140.12,59.47 140.12,60.11 U1M4.P26 | v135.67,66.78 134.72,65.82 U1M4.P18 134.4,65.51 134.4,65.19 | v129.96,68.36 130.59,67.73 131.23,67.73 131.86,67.09 131.86,66.46 132.18,66.46 133.45,65.19 134.4,65.19 | 134.4,65.19 135.04,65.19 U1M4.P19 135.35,64.87 135.67,64.87 135.99,64.55 U1M4.P20 135.99,64.24 v134.72,62.97 | LED48.1 122.34,40.74 v114.08,49 111.22,49 v110.91,48.68 | U1M3.P28 159.48,115.04 159.17,114.72 U1M3.P27 158.85,114.4 158.53,114.4 158.21,114.08 U1M3.P26 158.21,113.77 158.53,113.77 158.53,112.5 155.36,109.32 154.4,109.32 154.09,109.64 U1M3.P20 153.77,109.64 153.13,109 U1M3.P19 153.13,108.69 152.82,108.37 U1M3.P18 152.82,108.05 v153.77,107.1 | C3M3.2 141.39,104.88 v141.07,104.88 | v119.8,88.37 120.43,89 129.96,89 131.23,90.27 C2M4.- | v143.93,67.41 143.29,68.05 143.29,68.36 143.93,69 143.93,69.32 140.12,73.13 v140.12,73.76 | 106.46,109.96 106.46,113.13 107.1,113.13 109.64,115.67 3R12.1 | 105.83,108.69 4U2.6 105.83,104.56 105.19,104.56 103.6,102.97 103.6,97.26 102.97,97.26 | 105.83,108.69 4U2.P$6 106.14,109 | 105.83,108.69 106.14,109 | 106.14,109 4U2.9 | 106.14,109 106.46,109 4U2.P$4 | 107.41,109.64 107.41,109 4U2.P$2 | 106.46,109.96 105.83,109.96 4U2.P$5 | 4U2.P$3 4U2.9 | 106.46,109.96 4U2.9 | 107.41,109.64 4U2.P$1 | 107.41,109.64 4U2.9
  Top 0.203: 108.37,100.75 108.37,101.7 3C11.2 108.37,100.75 | 108.37,100.75 108.37,97.89 3C10.2 108.05,97.89 106.46,96.3 103.92,96.3 102.97,97.26 | 108.37,100.75 112.81,100.75 3D7.A | 102.97,97.26 v101.38,97.26 3C13.- | 108.37,83.6 v107.73,82.97 | v110.59,83.6 108.37,83.6 | 108.37,83.6 v98.21,83.6 v93.76,79.16 | R10M3.1 158.85,126.47 156.63,128.69 R9M3.2 156.31,129.01 v156.31,130.28 | R11M3.1 151.23,134.09 149.01,136.31 C1M3.1 148.69,136.63 148.37,136.63 v148.37,144.25 | v135.67,137.58 135.35,137.26 v132.81,137.26 | R11M1.1 66.77,57.89 69,55.66 C1M1.1 69.31,55.35 v72.17,55.35 | U1M1.P26 61.06,76.62 60.74,76.3 60.42,76.3 U1M1.P27 60.11,75.98 59.79,75.67 U1M1.P28 59.47,75.67 59.15,75.98 58.52,75.98 55.03,72.49 55.03,71.86 | 55.03,71.86 55.03,65.82 58.84,65.82 R10M1.1 59.15,65.51 61.38,63.28 R9M1.2 61.69,62.97 62.01,62.97 v62.01,62.01 | GND.1 23.28,71.86 55.03,71.86 | C3M1.2 81.38,89.32 81.38,90.27 C2M1.- | C2M2.- 81.7,100.43 86.14,104.88 90.27,104.88 90.27,115.99 89.32,116.94 89.32,118.85 C3M2.2 89.32,119.16 v89.32,128.05 100.75,128.05 v108.68,135.99 | U1M1.P18 66.46,82.33 66.14,82.02 U1M1.P19 66.14,81.7 65.5,81.06 U1M1.P20 65.5,80.75 66.14,80.11 v66.46,80.11 | U1M2.P18 83.28,126.47 82.97,126.78 U1M2.P19 82.65,127.1 82.33,127.1 82.01,127.42 U1M2.P20 82.01,127.74 82.33,127.74 82.33,129.01 80.43,130.91 | 80.43,130.91 79.16,132.18 78.2,132.18 77.89,131.86 U1M2.P26 77.57,131.86 76.93,132.5 U1M2.P27 76.93,132.82 76.62,133.13 U1M2.P28 76.62,133.45 78.52,135.36 LED49.1 77.25,151.23 72.81,151.23 69,147.42 57.88,147.42 v57.88,130.28 57.88,125.2 R11M2.1 57.57,124.88 55.34,122.66 C1M2.1
  Top 0.203: R10M2.1 65.19,132.5 62.96,130.28 R9M2.2 62.65,130.28 v60.42,130.28 | 80.43,130.91 v80.74,130.91
  Bottom 0.203: 181.07,94.4 175.04,94.4 174.72,94.08 171.23,94.08 LED44.C | 181.07,94.4 181.39,94.08 LED45.C 181.07,94.4 | 187.74,94.4 188.06,94.08 191.55,94.08 LED46.C | 181.07,94.4 187.74,94.4 | 187.74,94.4 194.09,94.4 | 194.09,94.4 197.9,94.4 198.22,94.08 201.71,94.08 LED47.C | 194.09,94.4 194.09,73.76 | 194.09,73.76 J2.1 | 194.09,73.76 174.72,73.76 v163.29,62.33 145.83,44.87 145.83,40.11 145.2,39.47 140.75,39.47 LED48.1 139.48,42.65 132.18,49.95 131.54,49.95 113.45,31.85 | 69.63,71.86 68.68,71.86 LED6.C | 69.63,71.86 73.44,71.86 76.93,68.36 81.06,68.36 1C7.2 | 69.63,71.86 73.12,68.36 73.12,65.51 LED5.C 73.44,65.19 78.84,59.79 LED4.C 79.16,59.47 81.06,59.47 85.51,55.03 LED3.C 85.82,54.71 89.63,54.71 90.9,53.44 | 90.9,53.44 92.81,51.54 LED2.C 93.13,51.22 98.84,51.22 100.75,49.31 LED1.C 101.06,49 108.68,49 | 108.37,55.98 108.37,49.31 108.68,49 | 109,48.68 108.68,49 | 108.37,55.98 108.37,62.33 111.54,65.51 1R7.1 | 108.37,55.98 1C5.2 | 108.68,49 LED0.C 109,48.68 | v135.67,66.78 136.94,66.78 1C10.2 | v129.96,68.36 128.05,70.27 1R9.1 | 130.27,56.62 132.18,54.71 LED33.C 132.5,55.03 v136.94,59.47 138.21,59.47 | 130.27,56.62 125.19,61.7 1U4.P12 | 138.21,59.47 138.85,59.47 LED32.C 138.21,59.47 | 130.27,56.62 125.19,51.54 LED34.C 124.88,51.22 121.38,51.22 119.48,49.31 117.26,49.31 LED35.C 116.94,49 v114.08,49 | 138.21,59.47 v134.72,62.97 | 113.45,31.85 113.45,32.17 111.54,34.07 LED36.C | 113.45,31.85 113.45,28.68 111.54,26.77 LED37.C | v110.91,48.68 109,48.68 | 136.94,122.66 142.02,122.66 143.61,124.24 | 143.61,124.24 144.56,125.2 LED23.C | 143.61,124.24 143.93,124.24 149.32,118.85 LED24.C 149.64,118.53 149.64,114.72 152.82,111.54 LED25.C 153.13,111.23 153.13,107.73 v153.77,107.1 154.09,106.78
  Bottom 0.203: 155.36,95.03 155.36,87.41 LED28.C | 155.36,95.03 155.67,95.35 LED27.C 155.36,95.03 | 155.36,95.03 155.36,103.29 LED26.C 155.04,103.61 155.04,105.83 154.09,106.78 | 144.88,67.41 144.88,65.51 LED31.C | 144.88,67.41 149.32,71.86 LED30.C 149.64,72.17 149.64,74.4 152.82,77.57 152.82,79.16 LED29.C | 136.31,90.27 133.77,90.27 128.69,85.19 1C3.1 | v119.8,88.37 113.76,88.37 1U3.P12 | 136.31,90.27 136.31,100.43 C2M3.- 136.62,100.43 v141.07,104.88 152.18,104.88 154.09,106.78 | 136.31,90.27 C2M4.- 136.62,90.27 137.58,89.32 137.58,87.41 140.12,84.87 v140.12,73.76 | v143.93,67.41 144.88,67.41 | 1R6.1 100.11,79.16 99.48,78.52 98.84,78.52 95.67,81.7 95.67,83.6 | 95.67,83.6 95.67,85.19 1C1.1 | 1C4.2 1R11.1 112.81,80.75 113.76,81.7 113.76,82.97 113.13,83.6 v110.59,83.6 109,85.19 | 109,85.19 106.78,85.19 104.24,87.73 102.97,87.73 101.38,89.32 1R4.1 101.38,89.64 100.43,90.59 100.43,90.91 100.11,91.22 1R1.1 100.11,97.26 v101.38,97.26 | 109,85.19 1C2.1 | v107.73,82.97 1U1.P12 | v98.21,83.6 95.67,83.6 | v148.37,144.25 143.61,144.25 | 143.61,144.25 142.02,144.25 1R13.1 142.02,143.93 v135.67,137.58 | v156.31,130.28 156.31,132.18 150.59,137.9 150.59,140.12 148.37,142.34 145.51,142.34 143.61,144.25 | 109.64,141.39 109.64,135.99 | 109.64,135.99 109.64,134.72 1C6.2 | 109.64,141.39 109,142.02 LED18.C 109.64,141.39 | 109.64,141.39 114.4,141.39 | 114.4,141.39 116.94,141.39 LED19.C 117.26,141.39 119.16,139.48 124.88,139.48 LED20.C 125.19,139.17 128.37,135.99 131.54,135.99 | 131.54,135.99 132.18,135.99 LED21.C | LED21.C 132.5,135.67 136.94,131.23 138.85,131.23 LED22.C 138.85,130.91 138.85,129.01 135.99,126.15 135.99,123.61 136.94,122.66
  Bottom 0.203: 131.54,135.99 v132.81,137.26 | 131.54,135.99 LED21.C | 114.4,141.39 114.4,121.07 107.41,114.08 107.41,109.96 4U2.P$1 | 136.94,122.66 1C9.2 | 16.29,96.62 19.78,96.62 20.1,96.3 26.13,96.3 | 26.13,96.3 26.45,96.62 LED40.C 26.13,96.3 | 35.66,96.62 33.12,96.62 32.8,96.3 | 35.66,96.62 36.61,96.62 LED39.C 35.66,96.62 | 26.13,96.3 32.8,96.3 | 32.8,96.3 42.96,96.3 43.28,96.62 46.77,96.62 LED38.C | 1R12.1 75.98,51.54 v72.17,55.35 68.68,55.35 v62.01,62.01 | 16.29,96.62 15.66,96.62 13.75,94.72 13.75,81.38 GND.1 | 16.29,96.62 LED41.C | 1U2.P12 87.73,102.34 87.09,102.34 84.55,99.8 84.55,93.13 81.7,90.27 C2M1.- 79.79,90.27 75.03,85.51 65.5,85.51 64.23,84.24 | 66.14,80.43 65.19,79.48 LED7.C | 66.14,80.43 67.09,81.38 | 67.09,81.38 69.31,83.6 82.01,83.6 82.97,84.56 84.87,84.56 85.51,83.92 85.51,82.65 87.41,80.75 1R3.1 | 66.14,80.43 v66.46,80.11 | 62.65,98.84 62.33,98.53 62.33,95.35 LED9.C | 62.65,98.84 62.65,103.29 LED10.C 62.96,103.61 64.87,105.51 64.87,111.23 LED11.C 65.19,111.54 68.36,114.72 68.36,118.53 LED12.C 68.68,118.85 73.12,123.29 73.12,125.2 LED13.C | 62.65,98.84 62.65,96.94 | 62.65,96.94 62.65,87.41 LED8.C 62.96,87.1 62.96,85.51 64.23,84.24 | 64.23,84.24 67.09,81.38 | C2M2.- 79.79,100.43 76.3,96.94 62.65,96.94 | LED17.C 100.75,141.39 98.84,139.48 93.13,139.48 LED16.C 92.81,139.17 91.22,139.17 88.05,135.99 85.82,135.99 LED15.C 85.51,135.67 83.6,133.77 | 1C8.2 81.06,129.01 79.79,130.28 | 79.79,130.28 79.16,130.91 LED14.C | 83.6,133.77 v80.74,130.91 80.11,130.28 79.79,130.28 | LED43.C 106.46,163.93 104.56,162.03 104.56,160.44 106.46,158.53 LED42.C 106.46,156.31 84.87,156.31 LED49.1
  Bottom 0.203: v60.42,130.28 v57.88,130.28 50.58,130.28 35.66,115.35 35.66,96.62 | 83.6,133.77 v89.32,128.05 | v108.68,135.99 109.64,135.99 | 90.9,53.44 93.76,56.3 v93.76,79.16
  pour Top (isolate 0.305): 172.85,7.01 arc-6 162.53,0.4 arc-88 158.35,1.49 147.34,19.52 arc59 144.78,20.95 73.22,20.95 arc59 70.66,19.52 59.65,1.49 arc-88 55.47,0.4 arc-6 45.15,7.01 arc-99 44.91,10.05 63.75,28.88 arc90 63.75,31.71 31.22,64.24 arc90 28.39,64.24 13.26,49.11 arc-110 10.03,49.68 arc-50 10.03,141.02 arc-110 13.26,141.6 28.39,126.46 arc90 31.22,126.46 63.75,158.99 arc90 63.75,161.82 44.91,180.66 arc-99 45.15,183.69 arc-6 55.47,190.3 arc-88 59.65,189.22 70.66,171.19 arc59 73.22,169.75 144.78,169.75 arc59 147.34,171.19 158.35,189.22 arc-88 162.53,190.3 arc-6 172.85,183.69 arc-99 173.09,180.66 154.25,161.82 arc90 154.25,158.99 186.78,126.46 arc90 189.61,126.46 204.74,141.6 arc-110 207.97,141.02 arc-50 207.97,49.68 arc-110 204.74,49.11 189.61,64.24 arc90 186.78,64.24 154.25,31.71 arc90 154.25,28.88 173.09,10.05 arc-99
  pour Bottom (isolate 0.305): 172.85,7.01 arc-6 162.53,0.4 arc-88 158.35,1.49 147.34,19.52 arc59 144.78,20.95 73.22,20.95 arc59 70.66,19.52 59.65,1.49 arc-88 55.47,0.4 arc-6 45.15,7.01 arc-99 44.91,10.05 63.75,28.88 arc90 63.75,31.71 31.22,64.24 arc90 28.39,64.24 13.26,49.11 arc-110 10.03,49.68 arc-50 10.03,141.02 arc-110 13.26,141.6 28.39,126.46 arc90 31.22,126.46 63.75,158.99 arc90 63.75,161.82 44.91,180.66 arc-99 45.15,183.69 arc-6 55.47,190.3 arc-88 59.65,189.22 70.66,171.19 arc59 73.22,169.75 144.78,169.75 arc59 147.34,171.19 158.35,189.22 arc-88 162.53,190.3 arc-6 172.85,183.69 arc-99 173.09,180.66 154.25,161.82 arc90 154.25,158.99 186.78,126.46 arc90 189.61,126.46 204.74,141.6 arc-110 207.97,141.02 arc-50 207.97,49.68 arc-110 204.74,49.11 189.61,64.24 arc90 186.78,64.24 154.25,31.71 arc90 154.25,28.88 173.09,10.05 arc-99
INAM1  (via drill 0.25)
  Top 0.203: v70.58,59.79 73.76,56.62 75.03,56.62 R5M1.1 | v56.61,87.41 63.6,94.4 v75.03,94.4 | v80.11,99.48 80.11,101.38 v89.32,110.59 | v90.27,119.48 91.22,118.53 118.84,118.53 v123.61,113.77
  Bottom 0.203: v70.58,59.79 65.5,59.79 59.47,65.82 59.47,77.57 60.42,78.52 60.42,83.6 v56.61,87.41 | v80.11,99.48 v75.03,94.4 | v89.32,110.59 89.32,118.53 v90.27,119.48 | v123.61,113.77 125.19,112.18 125.19,110.59 J1.2
INAM2  (via drill 0.25)
  Top 0.203: v62.01,117.26 61.69,117.58 57.88,117.58 R5M2.1 | v59.47,111.86 55.98,115.35 55.34,115.35 53.76,116.94 53.76,148.06 63.92,148.06 82.01,166.15 v86.78,166.15 | v169.01,120.75 169.01,117.89 v169.64,117.26 | v169.64,101.7 168.69,100.75 162.02,100.75 161.39,101.38 153.77,101.38 153.45,101.07 v142.02,101.07 | v140.43,102.65 140.12,102.97 J1.8
  Bottom 0.203: v62.01,117.26 62.01,114.4 v59.47,111.86 | v86.78,166.15 130.27,166.15 150.91,145.52 152.18,145.52 162.02,135.67 162.02,127.74 v169.01,120.75 | v169.64,101.7 v169.64,117.26 | v140.43,102.65 v142.02,101.07
INAM3  (via drill 0.25)
  Top 0.203: v144.24,130.59 143.93,130.59 143.93,133.77 R5M3.1 | v154.09,105.51 v157.26,108.69 | v143.93,95.03 143.61,95.35 J1.14
  Bottom 0.203: v144.24,130.59 147.1,130.59 150.91,126.78 151.23,126.78 157.26,120.75 v157.26,108.69 | v154.09,105.51 143.93,95.35 v143.93,95.03
INAM4  (via drill 0.25)
  Top 0.203: v160.12,75.67 160.12,74.4 R5M4.1 | v159.8,83.92 155.36,88.37 147.74,88.37 147.1,87.73 133.77,87.73 133.13,87.1 126.15,87.1 125.51,87.73 J1.20
  Bottom 0.203: v160.12,75.67 160.12,83.6 v159.8,83.92
INBM1  (via drill 0.25)
  Top 0.203: v88.05,71.54 88.05,69.63 R6M1.2 | v96.3,66.46 v89,73.76 | v96.3,58.2 100.43,54.08 v147.42,54.08 | v168.69,78.84 162.66,84.87 162.02,84.87 160.12,82.97 159.48,82.97 155.04,87.41 v149.32,87.41 | v141.07,103.61 138.21,106.46 127.1,106.46 125.51,108.05 J1.4
  Bottom 0.203: v88.05,71.54 88.05,72.81 v89,73.76 | v96.3,58.2 v96.3,66.46 | v147.42,54.08 148.05,54.08 155.99,62.01 155.99,66.14 v168.69,78.84 | v149.32,87.41 142.97,93.76 142.97,101.7 v141.07,103.61
INBM2  (via drill 0.25)
  Top 0.203: v55.66,116.31 56.3,116.31 66.46,106.15 69.31,106.15 70.27,105.19 R6M2.2 | v132.81,141.07 127.42,135.67 v127.42,129.01 | v125.51,115.67 v125.51,127.1 | v129.32,104.56 129,104.24 122.02,104.24 118.84,101.07 118.84,98.53 121.38,98.53 122.02,99.16 123.92,99.16 125.19,100.43 J1.10
  Bottom 0.203: v55.66,116.31 55.66,124.24 71.54,140.12 71.54,149.96 87.09,165.52 108.37,165.52 v132.81,141.07 | v125.51,127.1 v127.42,129.01 | v125.51,115.67 125.51,112.5 129.32,108.69 v129.32,104.56
INBM3  (via drill 0.25)
  Top 0.203: v130.59,120.43 131.23,121.07 R6M3.2 | v131.23,93.45 130.59,92.81 J1.16
  Bottom 0.203: v130.59,120.43 130.59,102.65 130.91,102.34 130.91,93.76 v131.23,93.45
INBM4
  Top 0.203: J1.22 131.86,85.19 133.77,87.1 147.42,87.1 R6M4.2
LSOUT1  (via drill 0.25)
  Top 0.203: v100.75,76.62 101.06,76.94 v114.08,76.94 | v117.57,83.6 119.48,85.51 121.07,85.51 122.02,86.46 v124.24,86.46
  Bottom 0.203: 1JP2.2 106.46,73.13 104.87,71.54 102.33,71.54 100.75,73.13 v100.75,76.62 | v114.08,76.94 117.57,80.43 v117.57,83.6 | v124.24,86.46 125.83,86.46 129.64,90.27 129.64,95.35 125.83,99.16 124.24,99.16 122.97,100.43 J1.9
LSOUT2  (via drill 0.25)
  Top 0.203: v121.07,79.16 v105.51,79.16
  Bottom 0.203: 1JP4.2 102.65,74.71 103.29,75.35 103.29,76.94 v105.51,79.16 | v121.07,79.16 121.07,85.83 121.38,86.14 121.38,93.45 122.02,94.08 125.83,94.08 126.78,95.03 126.78,95.67 125.83,96.62 124.24,96.62 122.97,97.89 J1.11
LSOUT3  (via drill 0.25)
  Top 0.203: v105.19,85.51 106.14,86.46 114.4,86.46 v117.57,89.64
  Bottom 0.203: v105.19,85.51 1JP6.2 | v117.57,89.64 117.57,90.27 122.65,95.35 J1.13
N$1
  Bottom 0.203: PT0.EMITTER 104.53,57.25 97.43,64.35 97.43,77.64 96.3,78.77 96.3,78.84 92.24,82.91 92.24,94.96 88.68,98.51 1U2.P9
N$2
  Top 0.254: R3M1.2 76.65,61.23 U1M1.P5 73.6,64.28 72.83,64.28 72.18,63.63 72.18,63.61 72.15,63.58 72.13,63.58 70.21,61.66 R2M1.1
N$3  (via drill 0.35)
  Top 0.254: v72.83,59.79 72.83,61.36 72.88,61.41 72.88,62.17 U1M1.P3 | v68.36,64.87 68.36,66.91 U1M1.SLUG1
  Top 0.762: Q1M1.4 82.18,79.96 79.79,77.57 | 73.44,71.22 72.17,71.22 71.79,70.84 U1M1.SLUG1 U1M1.P23 | 79.79,77.57 73.44,71.22 | U1M1.P13 77.97,71.22 73.44,71.22 | C2M1.+ 74.71,86.97 74.71,83.99 C3M1.1 79.79,78.91 79.79,77.57
  Bottom 0.203: v72.83,59.79 71.56,61.06 70.9,61.06 68.36,63.6 v68.36,64.87
N$4
  Top 0.254: R4M1.1 82.46,68.01 80.59,66.14 77.39,66.14 U1M1.P9 76.12,67.41 73.8,67.41 69.63,63.25 67.47,63.25 61.43,69.28 R1M1.1
N$5
  Top 0.254: U1M1.P10 78.35,66.6 80.4,66.6 83.48,69.68 85.93,69.68 R6M1.1
N$6
  Top 0.254: R5M1.2 73.58,58.38 73.58,62.88 U1M1.P4
N$7
  Top 0.254: R8M1.2 81.43,65.47 80.83,64.87 77.25,64.87 U1M1.P8 75.72,66.4 73.66,66.4 70.05,62.79 67.28,62.79 63.33,66.74 R10M1.2
N$8
  Top 0.254: R7M1.1 78.52,63.6 77.11,63.6 U1M1.P7
N$9  (via drill 0.25)
  Top 0.203: v62.33,119.16 63.28,120.12 U1M2.P3 | v58.52,102.02 58.84,102.34 72.17,102.34 | 72.17,102.34 72.81,102.34 75.03,104.56 75.03,110.27 71.54,113.77 70.9,113.77 70.58,113.45 U1M2.P13 | v72.17,98.84 72.17,102.34
  Top 0.762: Q1M2.4 84.98,114.51 76.25,114.51 71.28,119.48 U1M2.SLUG1 U1M2.P23 | C3M2.1 85.99,118 Q1M2.4 | C2M2.+ 85.99,108.41 Q1M2.4
  Bottom 0.203: v62.33,119.16 58.52,115.35 v58.52,102.02 | v72.17,98.84 76.3,98.84 77.89,100.43 C2M2.+
N$10
  Top 0.254: R3M2.2 62.18,116.27 U1M2.P5 65.23,119.33 65.23,120.09 63.28,122.04 63.28,124.56 R2M2.1
N$11
  Top 0.254: R5M2.2 59.4,118.21 62.7,118.21 U1M2.P4
N$12
  Top 0.254: R12M1.1 28.14,83.46 D1M1.C D2M1.A
N$13
  Top 0.254: R4M2.1 68.96,111.26 67.31,112.91 67.31,115.75 U1M2.P9 68.06,116.5 68.06,119.2 65.01,122.25 65.01,125.64 68.96,129.6 R1M2.1
N$14
  Top 0.254: U1M2.P10 67.77,114.79 67.77,113.1 71.5,109.37 R6M2.1
N$15
  Top 0.254: R8M2.2 66.42,113.8 65.82,114.4 65.82,115.67 U1M2.P8 67.35,117.2 67.35,119.26 64.55,122.06 64.55,125.83 66.42,127.7 R10M2.2
N$16
  Top 0.254: R7M2.1 64.55,114.4 64.55,115.82 U1M2.P7
N$17
  Top 0.254: R12M2.1 28.14,108.86 D1M2.C D2M2.A
N$18  (via drill 0.35)
  Top 0.203: U1M3.P23 155.99,111.86 147.74,120.12 U1M3.SLUG1
  Top 0.254: U1M3.SLUG1 150.91,123.79 v150.91,125.83 | v145.9,129.71 145.9,129.02 U1M3.P3
  Top 0.762: Q1M3.4 138.21,118.21 142.02,118.21 | U1M3.SLUG1 147.87,120.75 147.1,120.75 144.56,118.21 142.02,118.21 | 142.02,118.21 142.02,118.76 | 142.02,118.76 U1M3.P13 | 142.02,118.76 143.89,116.89 C3M3.1 144.56,106.71 144.56,105 C2M3.+
  Bottom 0.203: v150.91,125.83 147.03,129.71 v145.9,129.71
N$19
  Top 0.254: R3M3.2 144.56,128.37 144.56,127.53 U1M3.P5 145.68,126.42 146.44,126.42 148.39,128.37 150.91,128.37 R2M3.1
N$20
  Top 0.254: R5M3.2 145.16,130.24 144.56,129.64 144.56,129.02 146.03,127.54 U1M3.P4
N$21
  Top 0.254: R1M3.1 158.48,122.69 154.55,126.62 148.58,126.62 145.55,123.59 142.85,123.59 U1M3.P9 142.02,124.42 142.02,124.56 138.73,124.56 138.21,124.04 136.35,124.04 R4M3.1
N$22
  Top 0.254: R6M3.1 133.73,121.42 135.98,121.42 138.14,123.58 141.44,123.58 U1M3.P10
N$23
  Top 0.254: R8M3.2 142.62,125.23 U1M3.P8 143.55,124.3 145.61,124.3 148.39,127.08 154.74,127.08 156.59,125.23 R10M3.2
N$24
  Top 0.254: R7M3.1 141.5,127.77 U1M3.P7
N$25
  Top 0.254: D2M3.A 190.28,108.44 | 190.28,108.44 D1M3.C | R12M3.1 188.59,106.75 190.28,108.44
N$26  (via drill 0.25, 0.35)
  Top 0.203: v156.63,71.86 156.31,72.17 155.04,72.17 154.72,71.86 U1M4.P3 | v153.45,68.68 151.55,70.59 146.78,70.59 U1M4.SLUG1
  Top 0.762: 128.34,73.76 136.94,73.76 138.21,75.03 140.75,75.03 | 140.75,75.03 142.53,75.03 U1M4.SLUG1 144.18,73.38 144.18,75.37 U1M4.P13 | 128.2,71.44 C3M4.1 134.4,61.06 136.94,61.06 | 136.94,61.06 | 136.94,61.06 U1M4.P23 | 140.75,75.03 142.02,76.3 v142.02,77.57
  Top 1.016: 128.34,73.76 Q1M4.4 128.2,71.44
  Bottom 0.203: v153.45,68.68 v156.63,71.86
  Bottom 0.762: v142.02,77.57 142.02,88.24 C2M4.+
N$27  (via drill 0.35)
  Top 0.254: U1M4.P5 153.88,73.76 154.72,73.76 R3M4.2 156.66,74.36 v157.26,73.76 | v145.83,57.25 148.44,57.25 R2M4.1
  Bottom 0.203: v157.26,73.76 157.26,73.51 152.18,68.43 152.18,66.14 145.83,59.79 v145.83,57.25
N$28
  Top 0.254: R5M4.2 158.67,72.64 154.17,72.64 U1M4.P4
N$29
  Top 0.254: R4M4.1 149.04,81.98 151.96,79.07 151.96,77.49 U1M4.P9 149.64,75.18 149.64,73.72 155.46,67.9 155.46,66.51 152.92,63.97 152.92,61.73 R1M4.1
N$30
  Top 0.254: R6M4.1 146.5,83.88 151.5,78.88 151.5,78.45 U1M4.P10
N$31
  Top 0.254: R8M4.2 152.85,79.51 152.85,76.97 U1M4.P8 150.65,74.77 150.65,74.01 151.6,73.05 151.6,72.4 155.92,68.09 155.92,66.32 155.31,65.71 155.31,64.12 R10M4.2
N$32
  Top 0.254: R7M4.1 153.45,77.57 153.45,76.16 U1M4.P7
N$33
  Top 0.254: D2M4.A 190.28,83.04 | 190.28,83.04 D1M4.C | R12M4.1 189.01,79.26 189.01,81.77 190.28,83.04
N$46
  Top 0.203: 3C12.1 112.81,110.27 111.54,111.54 108.37,111.54 4U2.1
N$48
  Top 0.508: 3D7.C 112.81,106.78 | 112.81,106.78 3C12.2 111.2,106.86 4U2.8 | 3L3.1 100.86,116.42 101.38,116.94 112.81,116.94 115.35,114.4 115.35,109.32 112.81,106.78
N$49
  Top 0.254: 4U2.4 104.56,114.19 3R11.1 3R12.2
N$50
  Bottom 0.203: 1U2.P15 99.07,99.78 1R1.2
N$51
  Bottom 0.203: PT1.EMITTER 97.02,77.47 91.78,82.72 91.78,94.14 88.68,97.24 1U2.P8
N$52
  Bottom 0.203: PT2.EMITTER 91.22,57.23 91.22,93.04 88.29,95.97 1U2.P7
N$53
  Bottom 0.203: PT3.EMITTER 90.76,67.25 90.76,92.23 88.29,94.7 1U2.P6
N$54
  Bottom 0.203: PT4.EMITTER 78.34,64.8 78.42,64.89 78.7,64.89 78.78,64.8 87.34,64.8 90.31,67.77 90.31,91.41 88.29,93.43 1U2.P5
N$55
  Bottom 0.203: PT5.EMITTER 72.78,70.66 73.82,70.66 79.22,65.26 87.15,65.26 89.81,67.91 89.81,90.64 88.29,92.16 1U2.P4
N$56
  Bottom 0.203: PT6.EMITTER 88.52,77.41 89.35,78.24 89.35,89.83 88.29,90.89 1U2.P3
N$57
  Bottom 0.203: 1U2.P2 87.29,89.62 82.3,84.63 PT7.EMITTER
N$58
  Bottom 0.203: PT8.EMITTER 79.69,92.18 83.87,96.35 83.87,104.24 85.27,105.65 86.27,105.65 89.95,101.97 89.95,97.89 92.69,95.14 92.69,92.61 95.68,89.62 1U2.P23
N$59
  Bottom 0.203: PT9.EMITTER 74.71,99.82 81.67,106.78 85.78,106.78 90.41,102.16 90.41,98.08 93.15,95.33 93.15,93.42 95.68,90.89 1U2.P22
N$60
  Bottom 0.203: 1U2.P21 95.78,92.16 93.61,94.34 93.61,95.52 90.86,98.27 90.86,102.68 86.22,107.33 PT10.EMITTER
N$61
  Bottom 0.203: PT11.EMITTER 72.68,111.32 72.68,110.28 75.17,107.79 86.41,107.79 91.32,102.87 91.32,98.46 94.07,95.71 94.07,95.05 95.68,93.43 1U2.P20
N$62
  Bottom 0.203: PT12.EMITTER 76.79,117.7 77.56,117.7 91.78,103.49 91.78,98.65 94.52,95.9 94.52,95.35 95.17,94.7 1U2.P19
N$63
  Bottom 0.203: PT13.EMITTER 78.45,126.01 78.54,125.93 78.54,117.38 92.24,103.68 92.24,98.83 95.1,95.97 1U2.P18
N$64
  Bottom 0.203: 1U2.P17 94.48,97.24 92.69,99.02 92.69,103.87 84.87,111.69 84.87,131.16 PT14.EMITTER
N$65
  Bottom 0.203: 1U2.P16 93.85,98.51 93.15,99.21 93.15,104.05 91.22,105.98 91.22,135.21 PT15.EMITTER
N$66
  Bottom 0.203: 1R4.2 101.38,90.91 104.24,90.91 1U3.P15
N$67
  Bottom 0.203: 1R2.1 1R3.2
N$68  (via drill 0.25)
  Top 0.203: v92.17,116.94 92.49,116.62 99.16,116.62 99.79,115.99 99.79,106.78 v102.33,106.78
  Bottom 0.203: v92.17,116.94 92.17,129.01 98.21,135.04 98.21,137.58 PT16.EMITTER | v102.33,106.78 110.27,98.84 110.27,93.76 111.86,92.18 113.45,92.18 1U3.P9
N$69  (via drill 0.25)
  Top 0.203: v93.13,105.19 93.13,94.4 94.71,94.4 95.03,94.08 102.97,94.08 103.29,94.4 110.91,94.4 v111.22,94.08
  Bottom 0.203: v93.13,105.19 93.13,129.32 98.84,135.04 102.02,135.04 105.83,138.85 PT17.EMITTER | v111.22,94.08 112.81,94.08 113.45,93.45 1U3.P8
N$70
  Bottom 0.203: 1R6.2 1R5.1
N$71  (via drill 0.25)
  Top 0.203: v95.03,100.11 95.03,94.72 102.97,94.72 103.29,95.03 v111.86,95.03
  Bottom 0.203: v95.03,100.11 95.03,100.75 95.98,101.7 98.52,101.7 101.38,104.56 101.38,108.69 113.45,120.75 113.45,138.85 PT18.EMITTER | v111.86,95.03 113.13,95.03 113.45,94.72 1U3.P7
N$72  (via drill 0.25)
  Top 0.203: v120.75,117.89 v120.75,127.1 | v117.26,104.56 117.26,97.57 v115.67,97.57
  Bottom 0.203: v120.75,127.1 120.75,137.26 PT19.EMITTER | v120.75,117.89 120.75,113.45 117.26,109.96 v117.26,104.56 | v115.67,97.57 115.03,96.94 115.03,96.62 114.4,95.99 113.76,95.99 1U3.P6
N$73
  Bottom 0.203: PT20.EMITTER 128.05,134.72 128.05,133.13 114.4,119.48 114.4,116.31 111.54,113.45 111.54,98.84 113.13,97.26 113.45,97.26 1U3.P5
N$74  (via drill 0.25)
  Top 0.203: v116.3,102.34 116.3,99.8 v115.67,99.8
  Bottom 0.203: v116.3,102.34 118.21,104.24 118.21,110.27 134.4,126.47 134.4,130.59 PT21.EMITTER | v115.67,99.8 114.4,98.53 113.76,98.53 1U3.P4
N$75  (via drill 0.25)
  Top 0.203: v138.21,126.78 138.21,128.37 137.58,128.37 v137.26,128.69
  Bottom 0.203: v138.21,126.78 139.16,125.83 140.43,125.83 PT22.EMITTER | v137.26,128.69 118.84,110.27 118.84,103.61 116.62,101.38 115.35,101.38 115.03,101.7 112.49,101.7 112.18,101.38 112.18,100.75 113.13,99.8 113.45,99.8 1U3.P3
N$76  (via drill 0.25)